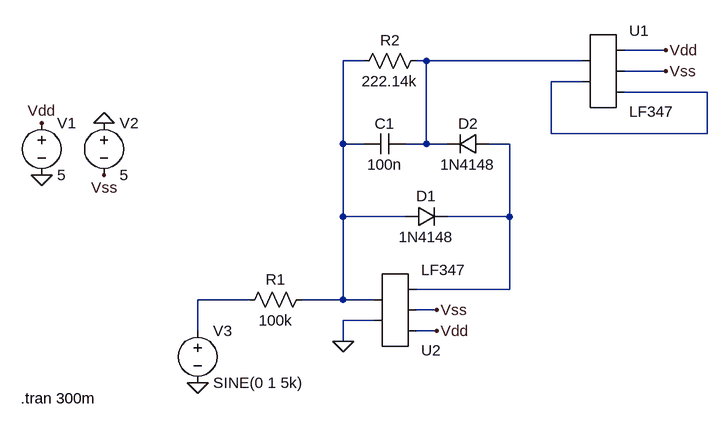
[diagram p0: schematic AnalogEx8.asc]
AnalogEx8.asc, the LTspice schematic file:
Version 4
SHEET 1 1412 680
WIRE 608 -352 544 -352
WIRE 144 -336 112 -336
WIRE 240 -336 224 -336
WIRE 480 -336 240 -336
WIRE 608 -320 544 -320
WIRE 480 -304 432 -304
WIRE 672 -288 544 -288
WIRE 432 -224 432 -304
WIRE 672 -224 672 -288
WIRE 672 -224 432 -224
WIRE 112 -208 112 -336
WIRE 144 -208 112 -208
WIRE 240 -208 240 -336
WIRE 240 -208 208 -208
WIRE 272 -208 240 -208
WIRE 368 -208 336 -208
WIRE 112 -96 112 -208
WIRE 208 -96 112 -96
WIRE 368 -96 368 -208
WIRE 368 -96 272 -96
WIRE 368 16 368 -96
WIRE 368 16 224 16
WIRE -32 32 -112 32
WIRE 112 32 112 -96
WIRE 112 32 48 32
WIRE 160 32 112 32
WIRE 256 48 224 48
WIRE 160 64 112 64
WIRE -112 80 -112 32
WIRE 256 80 224 80
WIRE 112 96 112 64
FLAG -352 -160 0
FLAG -256 -240 0
FLAG -352 -240 Vdd
FLAG -256 -160 Vss
FLAG 256 80 Vdd
FLAG 256 48 Vss
FLAG -112 160 0
FLAG 112 96 0
FLAG 608 -352 Vdd
FLAG 608 -320 Vss
SYMBOL voltage -352 -256 R0
WINDOW 123 0 0 Left 0
WINDOW 39 0 0 Left 0
SYMATTR InstName V1
SYMATTR Value 5
SYMBOL voltage -256 -256 R0
WINDOW 123 0 0 Left 0
WINDOW 39 0 0 Left 0
SYMATTR InstName V2
SYMATTR Value 5
SYMBOL res 64 16 R90
WINDOW 0 0 56 VBottom 2
WINDOW 3 32 56 VTop 2
SYMATTR InstName R1
SYMATTR Value 100k
SYMBOL voltage -112 64 R0
WINDOW 123 0 0 Left 0
WINDOW 39 0 0 Left 0
SYMATTR InstName V3
SYMATTR Value SINE(0 1 5k)
SYMBOL diode 208 -80 R270
WINDOW 0 32 32 VTop 2
WINDOW 3 0 32 VBottom 2
SYMATTR InstName D1
SYMATTR Value 1N4148
SYMBOL diode 336 -224 R90
WINDOW 0 0 32 VBottom 2
WINDOW 3 32 32 VTop 2
SYMATTR InstName D2
SYMATTR Value 1N4148
SYMBOL cap 208 -224 R90
WINDOW 0 0 32 VBottom 2
WINDOW 3 32 32 VTop 2
SYMATTR InstName C1
SYMATTR Value 100n
SYMBOL res 240 -352 R90
WINDOW 0 0 56 VBottom 2
WINDOW 3 32 56 VTop 2
SYMATTR InstName R2
SYMATTR Value 222.14k
SYMBOL AutoGenerated\\LF347 512 -320 R0
SYMATTR InstName U1
SYMBOL AutoGenerated\\LF347 192 48 M180
SYMATTR InstName U2
TEXT -384 184 Left 2 !.tran 300m

The netlist it stands for:
* AnalogEx8.asc
V1 Vdd 0 5
V2 0 Vss 5
R1 N001 N005 100k
V3 N005 0 SINE(0 1 5k)
D1 N001 N004 1N4148
D2 N004 N002 1N4148
C1 N002 N001 100n
R2 N002 N001 222.14k
* U1: LF347 (symbol AutoGenerated\LF347 not available, pins judged from their places): pin1=N002 pin2=N003 pin3=Vdd pin4=Vss pin5=N003
* U2: LF347 (symbol AutoGenerated\LF347 not available, pins judged from their places): pin1=0 pin2=N001 pin3=Vdd pin4=Vss pin5=N004
.model D D
.lib standard.dio
.tran 300m
.backanno
.end